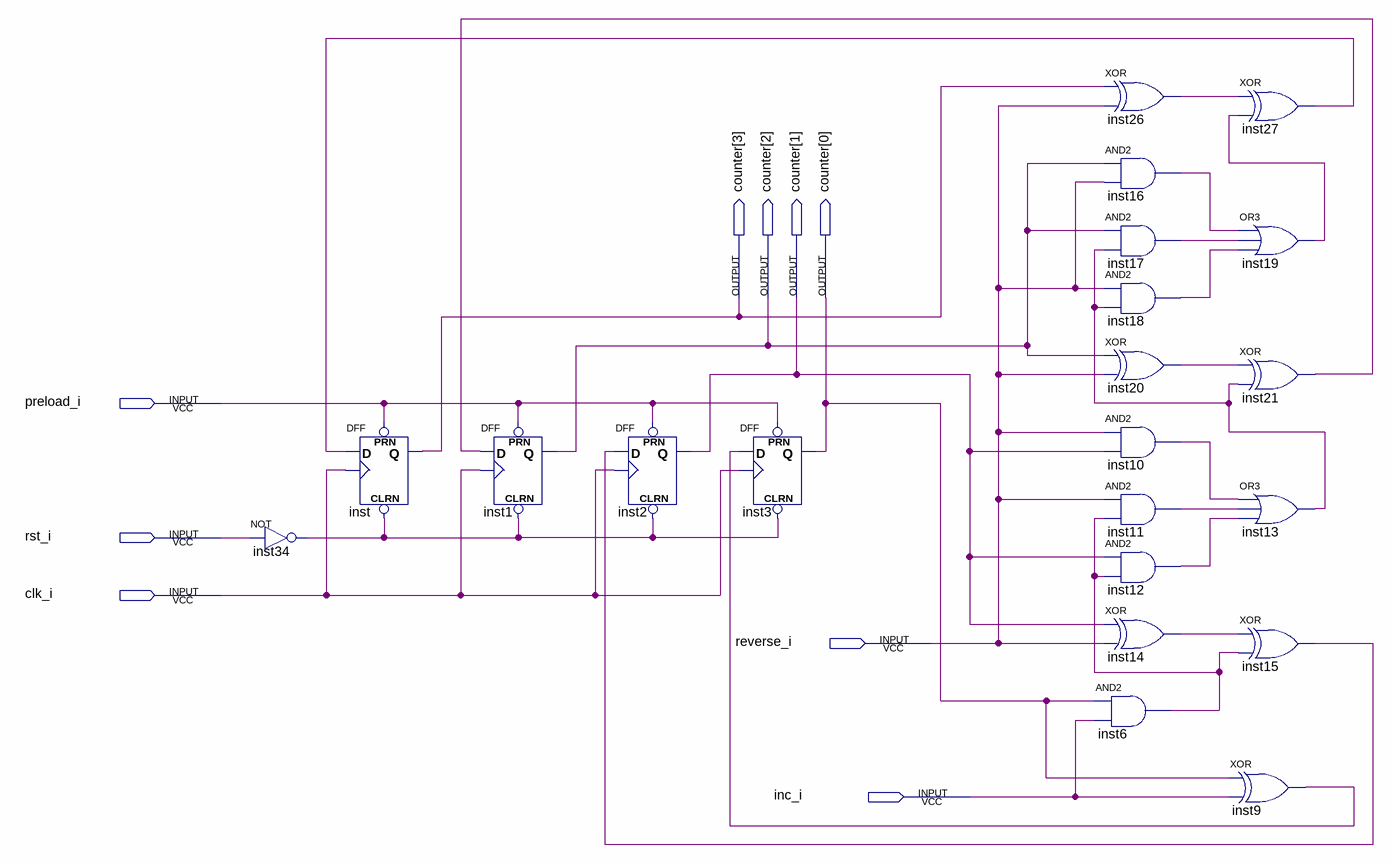
[diagram p0: schematic sheet]
// Quartus schematic top.bdf as structural Verilog: 21 symbols, 9 pins
module top (
  input  preload_i,
  input  rst_i,
  input  clk_i,
  input  reverse_i,
  input  inc_i,
  output [3:0] counter
);

  wire inst6_out, inst9_out, inst10_out, inst11_out, inst12_out, inst13_out, inst14_out, inst15_out,
       inst16_out, inst17_out, inst18_out, inst19_out, inst20_out, inst21_out, inst26_out, inst27_out,
       inst34_out;

  not inst34 (inst34_out, rst_i);
  DFF inst (.CLRN(inst34_out), .CLK(clk_i), .D(inst27_out), .PRN(preload_i), .Q(counter[3]));
  DFF inst1 (.CLRN(inst34_out), .CLK(clk_i), .D(inst21_out), .PRN(preload_i), .Q(counter[2]));
  DFF inst2 (.CLRN(inst34_out), .CLK(clk_i), .D(inst15_out), .PRN(preload_i), .Q(counter[1]));
  DFF inst3 (.CLRN(inst34_out), .CLK(clk_i), .D(inst9_out), .PRN(preload_i), .Q(counter[0]));
  xor inst26 (inst26_out, counter[3], reverse_i);
  and inst16 (inst16_out, counter[2], reverse_i);
  and inst17 (inst17_out, counter[2], inst13_out);
  and inst18 (inst18_out, reverse_i, inst13_out);
  xor inst20 (inst20_out, counter[2], reverse_i);
  and inst10 (inst10_out, reverse_i, counter[1]);
  and inst11 (inst11_out, reverse_i, inst6_out);
  and inst12 (inst12_out, counter[1], inst6_out);
  xor inst14 (inst14_out, counter[1], reverse_i);
  and inst6 (inst6_out, counter[0], inc_i);
  xor inst27 (inst27_out, inst26_out, inst19_out);
  or inst19 (inst19_out, inst16_out, inst17_out, inst18_out);
  xor inst21 (inst21_out, inst20_out, inst13_out);
  or inst13 (inst13_out, inst10_out, inst11_out, inst12_out);
  xor inst15 (inst15_out, inst14_out, inst6_out);
  xor inst9 (inst9_out, counter[0], inc_i);
endmodule
